# EasyEDA Pro project team_3.eprj

# Schematic main_board
Create Date: 2023-09-28; Page Name: P1; Project Name: team_3; Schematic Name: main_board; Update Date: 2023-11-21; Company: EasyEDA.com; Page Size: A3; Part Number: Esp32_main_borad; Version: V0.1
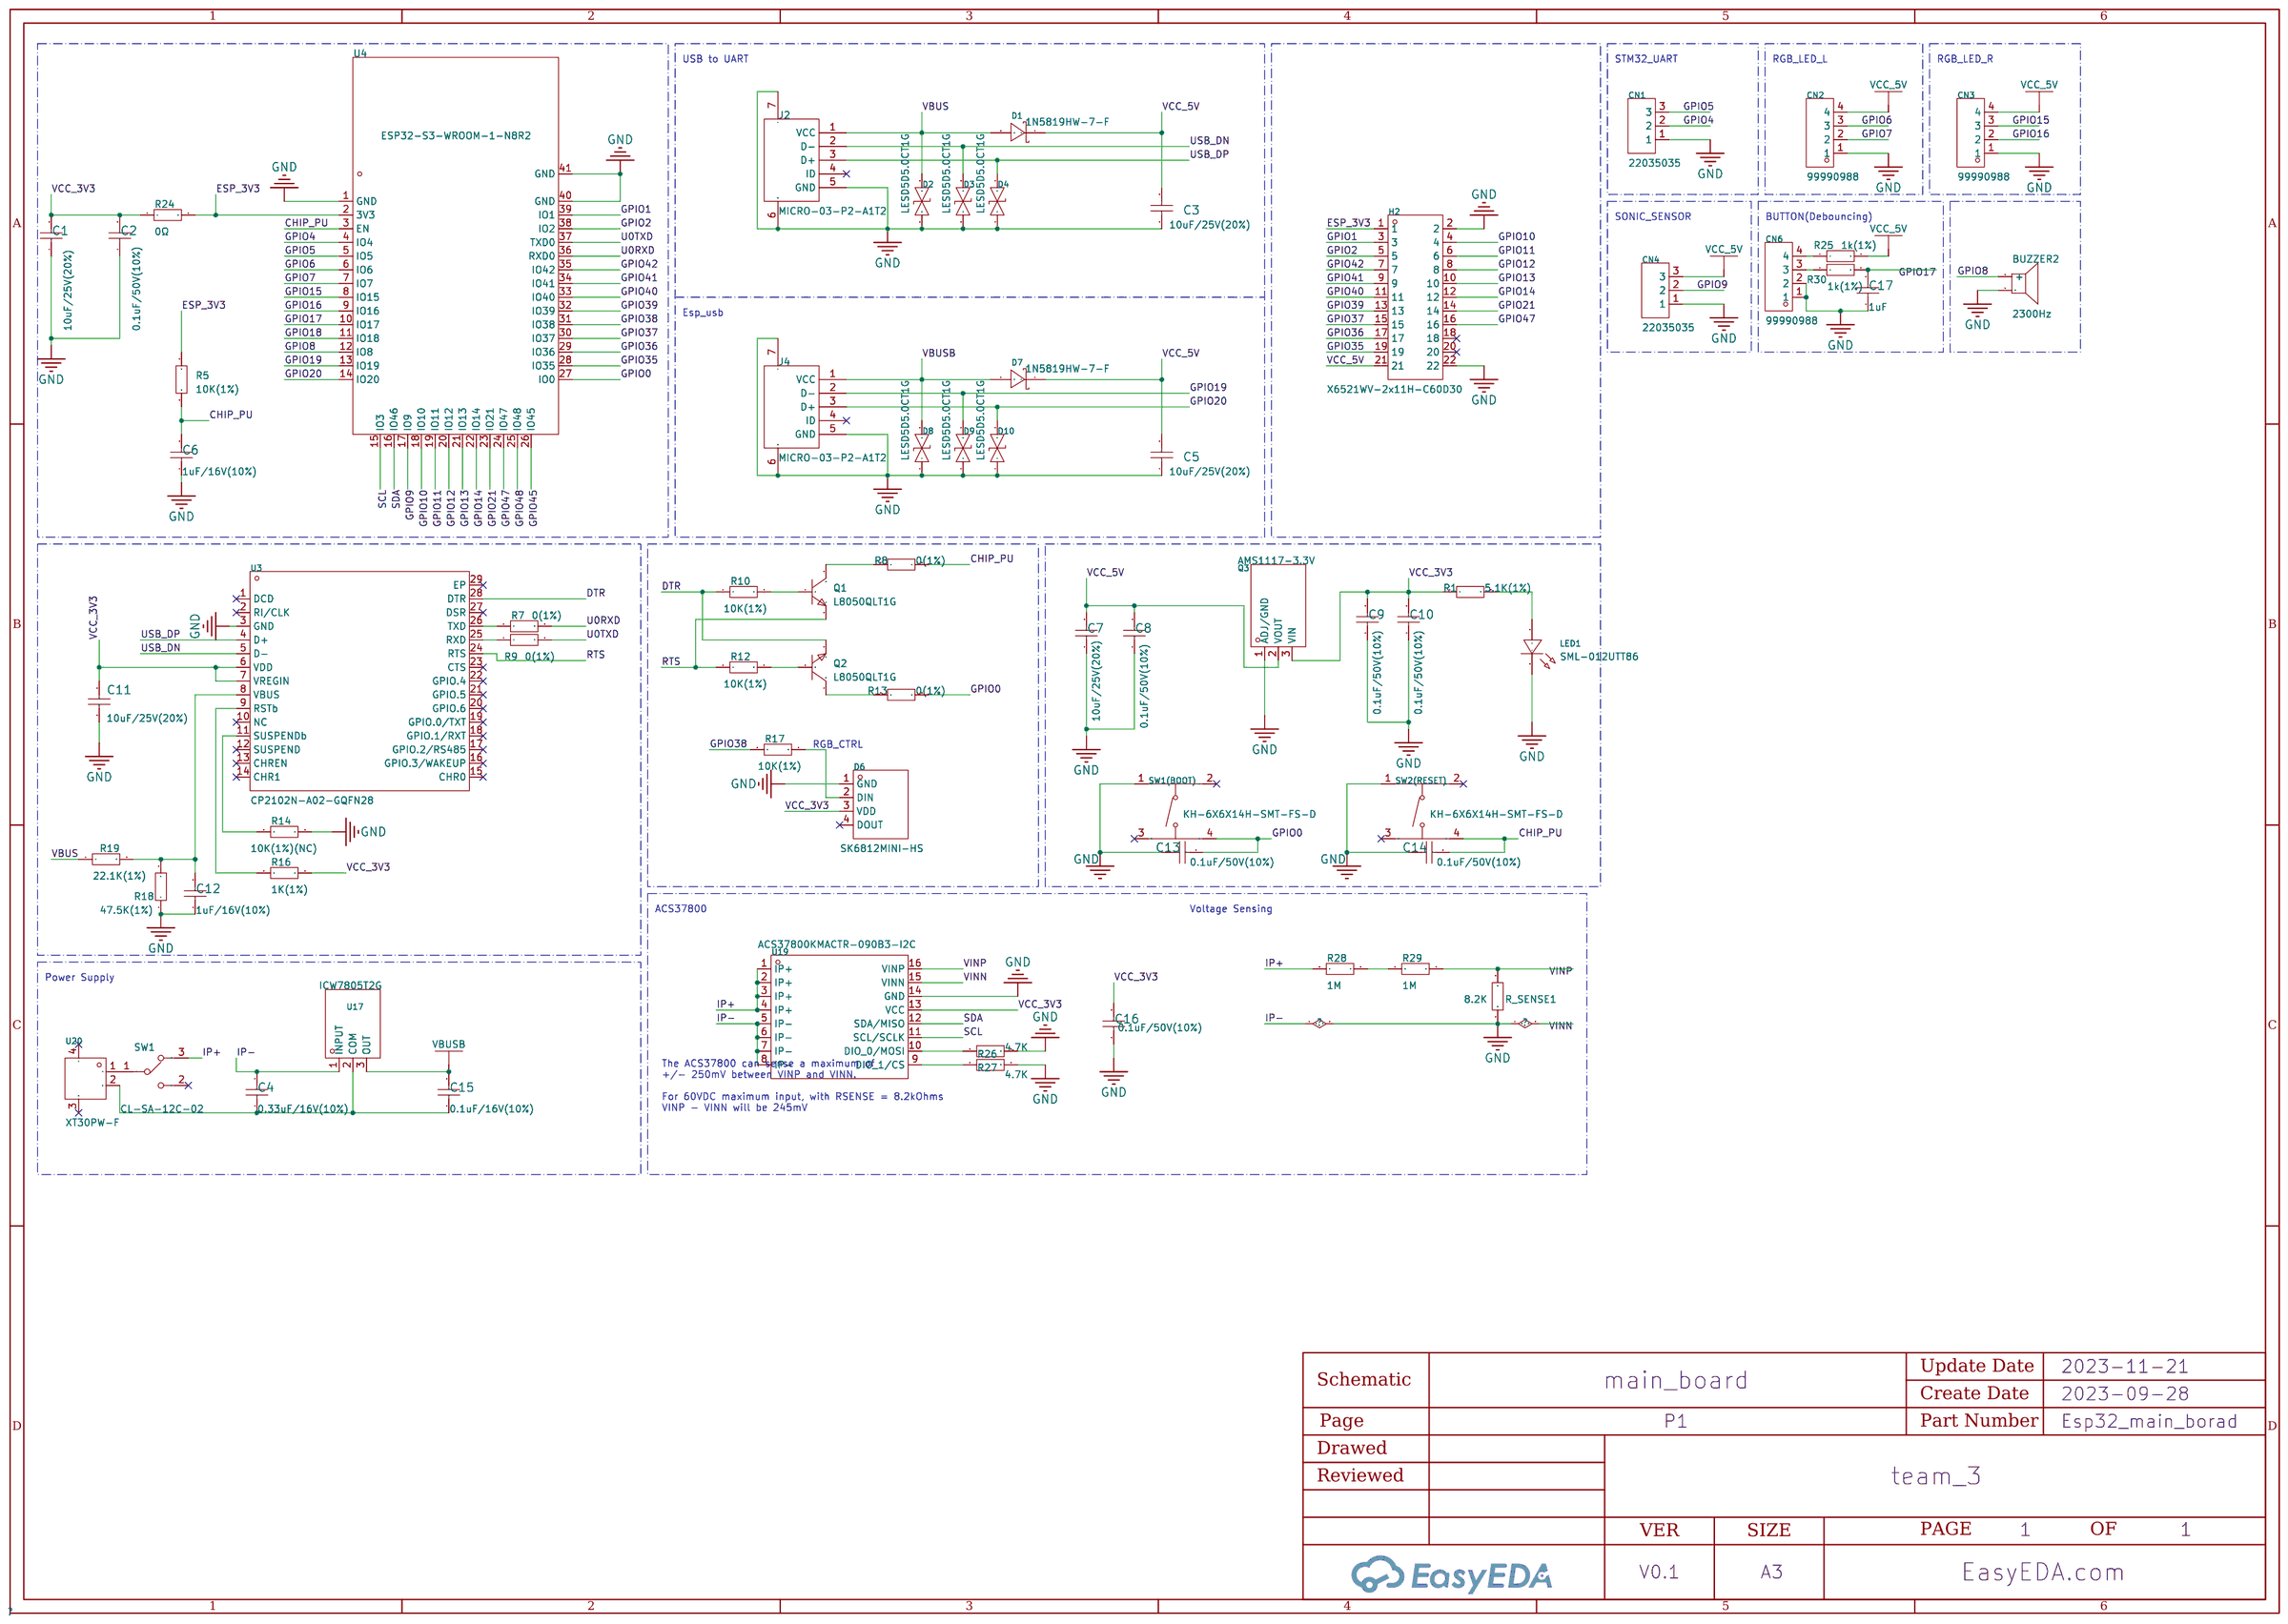
[diagram p0: schematic sheet]

## Parts
BUZZER2  2300Hz  [BUZ-TH_BD12.0-P7.60-D0.6-FD]
C1  10uF/25V(20%)  [C1206]
C2  0.1uF/50V(10%)  [C1206]
C3  10uF/25V(20%)  [C1206]
C4  0.33uF/16V(10%)  [C1206]
C5  10uF/25V(20%)  [C1206]
C6  1uF/16V(10%)  [C1206]
C7  10uF/25V(20%)  [C1206]
C8  0.1uF/50V(10%)  [C1206]
C9  0.1uF/50V(10%)  [C1206]
C10  0.1uF/50V(10%)  [C1206]
C11  10uF/25V(20%)  [C1206]
C12  1uF/16V(10%)  [C1206]
C13  0.1uF/50V(10%)  [C1206]
C14  0.1uF/50V(10%)  [C1206]
C15  0.1uF/16V(10%)  [C1206]
C16  0.1uF/50V(10%)  [C1206]
C17  1uF  [C1206]
CN1  22035035  [CONN-TH_22035035]
CN2  99990988  [CONN-TH_4P-P2.50_99990988]
CN3  99990988  [CONN-TH_4P-P2.50_99990988]
CN4  22035035  [CONN-TH_22035035]
CN6  99990988  [CONN-TH_4P-P2.50_99990988]
D1  1N5819HW-7-F  [SOD-123_L2.7-W1.6-LS3.7-RD]
D2  LESD5D5.0CT1G  [SOD-523_L1.2-W0.8-LS1.6-BI]
D3  LESD5D5.0CT1G  [SOD-523_L1.2-W0.8-LS1.6-BI]
D4  LESD5D5.0CT1G  [SOD-523_L1.2-W0.8-LS1.6-BI]
D6  SK6812MINI-HS  [LED-SMD_4P-L3.5-W3.5-BR_SK6812MINI-HS]
D7  1N5819HW-7-F  [SOD-123_L2.7-W1.6-LS3.7-RD]
D8  LESD5D5.0CT1G  [SOD-523_L1.2-W0.8-LS1.6-BI]
D9  LESD5D5.0CT1G  [SOD-523_L1.2-W0.8-LS1.6-BI]
D10  LESD5D5.0CT1G  [SOD-523_L1.2-W0.8-LS1.6-BI]
H2  X6521WV-2x11H-C60D30  [HDR-TH_22P-2.54-V-M-R2-C11-S2.54]
J2  MICRO-03-P2-A1T2  [MICRO-USB-SMD_MICRO-03-PX-A1T2]
J4  MICRO-03-P2-A1T2  [MICRO-USB-SMD_MICRO-03-PX-A1T2]
LED1  SML-012UTT86  [LED-SMD_L3.0-W2.0-R-RD_RED]
Q1  L8050QLT1G  [SOT-23-3_L2.9-W1.3-P1.90-LS2.4-BR]
Q2  L8050QLT1G  [SOT-23-3_L2.9-W1.3-P1.90-LS2.4-BR]
Q3  AMS1117-3.3V  [SOT-89-3_L4.5-W2.5-P1.50-LS4.2-BR]
R1  5.1K(1%)  [R1206]
R5  10K(1%)  [R1206]
R7  0(1%)  [R1206]
R8  0(1%)  [R1206]
R9  0(1%)  [R1206]
R10  10K(1%)  [R1206]
R12  10K(1%)  [R1206]
R13  0(1%)  [R1206]
R14  10K(1%)(NC)  [R1206]
R16  1K(1%)  [R1206]
R17  10K(1%)  [R1206]
R18  47.5K(1%)  [R1206]
R19  22.1K(1%)  [R1206]
R24  0Ω  [R1206]
R25  1k(1%)  [R1206]
R26  4.7K  [R1206]
R27  4.7K  [R1206]
R28  1M  [R1206]
R29  1M  [R1206]
R30  1k(1%)  [R1206]
R_SENSE1  8.2K  [R1206]
SW1  CL-SA-12C-02  [SW-TH_NIDEC_CL-SA-12C-02]
SW1(BOOT)  KH-6X6X14H-SMT-FS-D  [SW-SMD_4P-L6.0-W6.0-P4.50-LS9.5]
SW2(RESET)  KH-6X6X14H-SMT-FS-D  [SW-SMD_4P-L6.0-W6.0-P4.50-LS9.5]
U3  CP2102N-A02-GQFN28  [QFN-28_L5.0-W5.0-P0.50-TL-EP3.3]
U4  ESP32-S3-WROOM-1-N8R2  [WIRELM-SMD_ESP32-S3-WROOM-1]
U17  ICW7805T2G  [TO-252-2_L6.6-W6.1-P4.57-LS9.9-BR-CW]
U19  ACS37800KMACTR-090B3-I2C  [SOIC-16_L10.3-W7.5-P1.27-LS10.3-BL]
U20  XT30PW-F  [CONN-TH_XT30PW-F]

## Library data of the parts
BUZZER2 = TMB12A03_C96222: Oscillator Circuit:有源(内含驱动线路) Technology Type:电磁式 Rated Voltage:3V Operating Voltage:1.5V~4V Operating Voltage:1.5V~4V Frequency:2300Hz Sound Pressure Level (SPL):85dB@3V,10cm Diameter (φD):12mm Height:9.8mm; LCSC Part Name: TMB12A03; Supplier Part: C96222; Manufacturer: 华能; Manufacturer Part: TMB12A03; Supplier Footprint: 插件,D=12mm; JLCPCB Part Class: Extended Part; Datasheet: https://atta.szlcsc.com/upload/public/pdf/source/20211202/CAFCFF4D10B388AA00F36865319470DA.pdf; Supplier: LCSC; Oscillator Circuit: 有源(内含驱动线路); Technology Type: 电磁式; Rated Voltage: 3V; Operating Voltage: 1.5V~4V; Sound Pressure Level (SPL): 85dB@3V,10cm; Diameter (φD): 12mm; Height: 9.8mm
C1-C17 = CL31A226KAHNNNE: Capacitance: Tolerance:±10% Tolerance:±10% Voltage Rated: Temperature Coefficient:; LCSC Part Name: 22uF ±10% 25V; Supplier Part: C12891; Manufacturer: SAMSUNG(三星); Supplier Footprint: 1206; JLCPCB Part Class: Basic Part; Datasheet: https://atta.szlcsc.com/upload/public/pdf/source/20160218/1457707763339.pdf; Supplier: LCSC; Tolerance: ±10%
CN1 CN4 = 22035035: Reference Series:- Pitch:2.5mm Pins Structure:1x3P Number of Rows:1 Number of PINs Per Row:3 Row Spacing:- Mounting Style:- Contact Material:Brass; LCSC Part Name: 间距:2.5mm 1x3P 接头 通孔 锡; Supplier Part: C293315; Manufacturer: MOLEX; Supplier Footprint: 插件,P=2.5mm; JLCPCB Part Class: Extended Part; Datasheet: https://atta.szlcsc.com/upload/public/pdf/source/20200310/C492369_7C2DB16545F7632C1BAB5C1CED51D20C.pdf; Supplier: LCSC; Pitch: 2.5mm; Pins Structure: 1x3P; Number of Rows: 1; Number of PINs Per Row: 3; Contact Material: Brass
CN2 CN3 CN6 = 99990988: Reference Series:- Pitch:2.5mm Pins Structure:1x4P Number of Rows:1 Number of PINs Per Row:4 Row Spacing:- Mounting Style:- Contact Material:Brass; LCSC Part Name: 间距:2.5mm 1x4P; Supplier Part: C293734; Manufacturer: MOLEX; Supplier Footprint: 插件,P=2.5mm; JLCPCB Part Class: Extended Part; Datasheet: https://atta.szlcsc.com/upload/public/pdf/source/20181030/C293735_7F6EC290C398C64C520A3F541E21BCCE.pdf; Supplier: LCSC; Pitch: 2.5mm; Pins Structure: 1x4P; Number of Rows: 1; Number of PINs Per Row: 4; Contact Material: Brass
D1 D7 = 1N5819HW-7-F: Reverse Voltage (Vr):40V Average Rectified Current (Io):1A Forward Voltage (Vf@If):450mV@1A Reverse Leakage Current (Ir):1mA@40V; LCSC Part Name: 电压:40V 电流:1A; Supplier Part: C82544; Manufacturer: DIODES(美台); Supplier Footprint: SOD-123; JLCPCB Part Class: Extended Part; Datasheet: https://atta.szlcsc.com/upload/public/pdf/source/20161024/1477288459223.pdf; Supplier: LCSC; Reverse Voltage (Vr): 40V; Average Rectified Current (Io): 1A; Forward Voltage (Vf@If): 450mV@1A; Reverse Leakage Current (Ir): 1mA@40V
D2-D4 D8-D10 = LESD5D5.0CT1G_C5246195: Supplier Part: C5246195; Manufacturer: Leiditech(雷卯电子); Supplier Footprint: SOD-523; JLCPCB Part Class: Extended Part; Datasheet: https://atta.szlcsc.com/upload/public/pdf/source/20221108/1C42B36F7D16189BC2911DA9C8277455.pdf; Supplier: LCSC
D6 = SK6812MINI-HS: Supplier Part: C2922787; Manufacturer: 欧思科光电; Supplier Footprint: SMD,3.5x3.7mm; JLCPCB Part Class: Extended Part; Datasheet: https://atta.szlcsc.com/upload/public/pdf/source/20230410/362AD3320BBA53091A00A690D4E4D8BC.pdf; Supplier: LCSC
H2 = X6521WV-2x11H-C60D30: Number of Rows:双排 Number of Pins:22P Pitch:2.54mm Pin Structure:2x11P Row Spacing:2.54mm Mounting Type:Straight Circluar Pins/Square Pins:Square Pins Current Rating (Max):3A Voltage Rating (Max):250V Length of Mating Pin:6mm Insulation Height:2.5mm Length; LCSC Part Name: 间距:2.54mm 2x11P 直插 方针 高镀金 抗氧化; Supplier Part: C725883; Manufacturer: XKB Connectivity(中国星坤); Supplier Footprint: 插件,P=2.54mm; JLCPCB Part Class: Extended Part; Supplier: LCSC; Number of Rows: 双排; Number of Pins: 22P; Pitch: 2.54mm; Pin Structure: 2x11P; Row Spacing: 2.54mm; Mounting Type: Straight; Circluar Pins/Square Pins: Square Pins; Current Rating (Max): 3A; Voltage Rating (Max): 250V; Length of Mating Pin: 6mm; Insulation Height: 2.5mm; Length of End Connection Pin: 3mm; Contact Plating: Gold; Operating Temperature Range: -40℃~+105℃; Welding Temperature (Max): 260℃; Color: Black
J2 J4 = MICRO-03-P2-A1T2: Connector Type:Micro-B Standard:USB 2.0 Gender:Female Number of Contacts:5P Number of Ports:1 Mounting Style:Surface Mount Current Rating - Power (Max):1A Operating Temperature Range:- Operating Temperature Range:-; LCSC Part Name: Micro-B 母座 卧贴 有柱全贴有卷边针1; Supplier Part: C2682529; Manufacturer: Yuandi(元迪); Supplier Footprint: SMD; JLCPCB Part Class: Extended Part; Datasheet: https://atta.szlcsc.com/upload/public/pdf/source/20210114/C2682530_1DA2D4DD26655E983BE5171A1C11B75A.pdf; Supplier: LCSC; Connector Type: Micro-B; Standard: USB 2.0; Gender: Female; Number of Contacts: 5P; Number of Ports: 1; Mounting Style: Surface Mount; Current Rating - Power (Max): 1A
LED1 = SML-012UTT86: Emitted Color:红灯 Lens Color:无色透明 Dominant Wavelength:620nm~630nm Dominant Wavelength:620nm~630nm Forward Current:20mA Forward Voltage (VF):2V Forward Voltage (VF):2V; Supplier Part: C5336666; Manufacturer: ROHM(罗姆); Supplier Footprint: 1208; JLCPCB Part Class: Extended Part; Datasheet: https://atta.szlcsc.com/upload/public/pdf/source/20221223/03B791BDED291591D378DC550DDAE65C.pdf; Supplier: LCSC; Emitted Color: 红灯; Lens Color: 无色透明; Dominant Wavelength: 620nm~630nm; Forward Current: 20mA; Forward Voltage (VF): 2V
Q1 Q2 = L8050QLT1G: Transistor Type: Collector-Emitter Breakdown Voltage (Vceo): Collector Current (Ic): Power Dissipation (Pd):; LCSC Part Name: NPN 25V 800mA; Supplier Part: C49581; Manufacturer: LRC(乐山无线电); Supplier Footprint: SOT-23; JLCPCB Part Class: Extended Part; Datasheet: https://atta.szlcsc.com/upload/public/pdf/source/20150518/1457707314424.pdf; Supplier: LCSC
Q3 = AMS1117-3.3V_C5120796: Output Type: Output Polarity:Positive Number of Outputs:1 Maximum Input Voltage:18V Output Voltage:3.3V Output Voltage:3.3V Dropout Voltage:1.4V@(1A) Quiescent Current (Ground Current):12mA Output Current:1A Operating Temperature:0℃~+125℃ Operating Temper; LCSC Part Name: 输入18V 输出3.3V 1A; Supplier Part: C5120796; Manufacturer: MSKSEMI(美森科); Supplier Footprint: SOT-89; JLCPCB Part Class: Extended Part; Datasheet: https://atta.szlcsc.com/upload/public/pdf/source/20230802/A3918E880B22D5DA08FB6633703CD81C.pdf; Supplier: LCSC; Output Polarity: Positive; Number of Outputs: 1; Maximum Input Voltage: 18V; Output Voltage: 3.3V; Dropout Voltage: 1.4V@(1A); Quiescent Current (Ground Current): 12mA; Output Current: 1A; Operating Temperature: 0℃~+125℃
R1 R5 R7-R10 R12-R14 R16-R19 R24-R30 R_SENSE1 = 1206W4F0000T5E: Type:Thick Film Resistors Resistance: Tolerance:±1% Tolerance:±1% Power(Watts):250mW Temperature Coefficient:±800ppm/℃ Temperature Coefficient:±800ppm/℃ Overload Voltage (Max): Operating Temperature Range:-55℃~+155℃ Operating Temperature Range:-55℃~+155℃; LCSC Part Name: 0Ω ±1% 250mW; Supplier Part: C17888; Manufacturer: UNI-ROYAL(厚声); Supplier Footprint: 1206; JLCPCB Part Class: Basic Part; Supplier: LCSC; Type: Thick Film Resistors; Tolerance: ±1%; Power(Watts): 250mW; Temperature Coefficient: ±800ppm/℃; Operating Temperature Range: -55℃~+155℃
SW1 = CL-SA-12C-02: Current Rating (DC):100mA Voltage Rating (DC):50V Circuit:SPDT Mounting Style:Straight Mechanical Life:- Actuator Color:White Pin Style:PCPin Operating Temperature:-40℃~+85℃ Operating Temperature:-40℃~+85℃ Switch Length:10mm Switch Width:2.54mm Switch Hei; LCSC Part Name: 直插两档 滑动开关; Supplier Part: C2921639; Manufacturer: NIDEC(尼得科); JLCPCB Part Class: Extended Part; Datasheet: https://atta.szlcsc.com/upload/public/pdf/source/20220330/3F9B16E5809B2A105669445D41B4F536.pdf; Supplier: LCSC; Current Rating (DC): 100mA; Voltage Rating (DC): 50V; Circuit: SPDT; Mounting Style: Straight; Actuator Color: White; Pin Style: PCPin; Operating Temperature: -40℃~+85℃; Switch Length: 10mm; Switch Width: 2.54mm; Switch Height: 6.4mm
SW1(BOOT) SW2(RESET) = KH-6X6X14H-SMT-FS-D: LCSC Part Name: 轻触开关6*6*14H防水贴片 袋装; Supplier Part: C18186518; Manufacturer: kinghelm(金航标); Supplier Footprint: SMD,6x6mm; Datasheet: https://atta.szlcsc.com/upload/public/pdf/source/20230919/ED0E7458BA42BEACFB6D3A5E00D3A6F9.pdf; Supplier: LCSC
U3 = CP2102N-A02-GQFN28: Applications Function:USB转UART Protocol:UART Supply Voltage:3V~3.6V Supply Voltage:3V~3.6V Operating Temperature:-40℃~+85℃@(Ta) Operating Temperature:-40℃~+85℃@(Ta); Supplier Part: C1550553; Manufacturer: SILICON LABS(芯科); Supplier Footprint: QFN-28-EP(5x5); JLCPCB Part Class: Extended Part; Datasheet: https://atta.szlcsc.com/upload/public/pdf/source/20201204/C964632_F2B790CC23A72455AEF523510305B30A.pdf; Supplier: LCSC; Applications Function: USB转UART; Protocol: UART; Supply Voltage: 3V~3.6V; Operating Temperature: -40℃~+85℃@(Ta)
U4 = ESP32-S3-WROOM-1-N8R2: Supplier Part: C2913204; Manufacturer: ESPRESSIF(乐鑫); Supplier Footprint: SMD,18x25.5mm; JLCPCB Part Class: Extended Part; Datasheet: https://atta.szlcsc.com/upload/public/pdf/source/20220628/A2AC12B3C87735CAEB7EBE2DBE80936C.pdf; Supplier: LCSC
U17 = ICW7805T2G: Maximum Input Voltage:40V Output Voltage:5V Output Voltage:5V Quiescent Current (Ground Current):3mA Output Current:1.2A; LCSC Part Name: 30V,1A固定输出,三端正电源稳压电路; Supplier Part: C7544936; Manufacturer: ICW(艾创微); Supplier Footprint: TO-252; Datasheet: https://atta.szlcsc.com/upload/public/pdf/source/20230825/646A12CA7BB340D06A31B928F5FFD201.pdf; Supplier: LCSC; Maximum Input Voltage: 40V; Output Voltage: 5V; Quiescent Current (Ground Current): 3mA; Output Current: 1.2A
U19 = ACS37800KMACTR-090B3-I2C: Output Type:- Reset Active Level:- Threshold Voltage:- Reset Timeout:- Operating Temperature:-40℃~+125℃@(TA) Operating Temperature:-40℃~+125℃@(TA) Type of the Power Management Chip:电源监控器; Supplier Part: C3686098; Manufacturer: ALLEGRO(美国埃戈罗); Supplier Footprint: SOP-16; JLCPCB Part Class: Extended Part; Supplier: LCSC; Operating Temperature: -40℃~+125℃@(TA); Type of the Power Management Chip: 电源监控器
U20 = XT30PW-F: Brand:艾迈斯 Model:XT30PW-F Power:- Output:- Input:- Size:- Interface:- Type:- Colour:- MaximumCurrent:- Type:航模插头 RatedVoltage:- Type1:- NumberOfUSBHoles:- InterfaceType:母头 MetalMaterial:- InsulationMaterial:- RatedCurrent:- RecommendedWireGauge:- FlameReta; LCSC Part Name: AMASS(艾迈斯)电源连接器 母头 XT30PW-F; Supplier Part: C2913282; Manufacturer: AMASS(艾迈斯); JLCPCB Part Class: Extended Part; Datasheet: https://atta.szlcsc.com/upload/public/pdf/source/20190916/C428722_DFF78979486FCB0B58C1FC563067EC88.pdf; Supplier: LCSC; Brand: 艾迈斯; Type: 航模插头; InterfaceType: 母头

## Nets
GND: BUZZER2.2 C1.1 C2.1 C3.1 C4.2 C5.1 C6.1 C7.1 C8.1 C9.1 C10.1 C11.1 C12.1 C13.1 C14.1 C16.1 C17.1 CN1.1 CN2.1 CN3.1 CN4.1 CN6.1 CN6.2 D2.1 D3.1 D4.1 D6.1(GND) D8.1 D9.1 D10.1 H2.2 H2.22 J2.5(GND) J2.6 J2.7 J4.5(GND) J4.6 J4.7 LED1.2(-) Q3.1(ADJ/GND) R14.2 R18.1 R26.2 R27.2 R_SENSE1.1 SW1(BOOT).1 SW2(RESET).1 U3.3(GND) U4.1(GND) U4.40(GND) U4.41(GND) U17.1(INPUT) U19.5(IP-) U19.6(IP-) U19.7(IP-) U19.8(IP-) U19.14(GND) U19.15(VINN)
VBUS: D1.2(A) D2.2 J2.1(VCC) R19.1
VBUSB: C15.2 D7.2(A) D8.2 J4.1(VCC) U17.3(OUT)
VCC_3V3: C1.2 C2.2 C9.2 C10.2 C11.2 C16.2 D6.3(VDD) Q3.3(VIN) R1.1 R16.2 R24.1 U3.6(VDD) U3.7(VREGIN) U19.13(VCC)
VCC_5V: C3.2 C5.2 C7.2 C8.2 CN2.4 CN3.4 CN4.3 D1.1(K) D7.1(K) H2.21 Q3.2(VOUT) R25.2
VINP: R29.2 R_SENSE1.2 U19.16(VINP)
CHIP_PU: C6.2 C14.2 R5.1 R8.2 SW2(RESET).4 U4.3(EN)
DTR: Q2.2(E) R10.1 U3.28(DTR)
ESP_3V3: H2.1 R5.2 R24.2 U4.2(3V3)
GPIO0: C13.2 R13.2 SW1(BOOT).4 U4.27(IO0)
GPIO1: H2.3 U4.39(IO1)
GPIO2: H2.5 U4.38(IO2)
GPIO4: CN1.2 U4.4(IO4)
GPIO5: CN1.3 U4.5(IO5)
GPIO6: CN2.3 U4.6(IO6)
GPIO7: CN2.2 U4.7(IO7)
GPIO8: BUZZER2.1(+) U4.12(IO8)
GPIO9: CN4.2 U4.17(IO9)
GPIO10: H2.4 U4.18(IO10)
GPIO11: H2.6 U4.19(IO11)
GPIO12: H2.8 U4.20(IO12)
GPIO13: H2.10 U4.21(IO13)
GPIO14: H2.12 U4.22(IO14)
GPIO15: CN3.3 U4.8(IO15)
GPIO16: CN3.2 U4.9(IO16)
GPIO17: C17.2 R30.2 U4.10(IO17)
GPIO18: U4.11(IO18)
GPIO19: D9.2 J4.2(D-) U4.13(IO19)
GPIO20: D10.2 J4.3(D+) U4.14(IO20)
GPIO21: H2.14 U4.23(IO21)
GPIO35: H2.19 U4.28(IO35)
GPIO36: H2.17 U4.29(IO36)
GPIO37: H2.15 U4.30(IO37)
GPIO38: R17.1 U4.31(IO38)
GPIO39: H2.13 U4.32(IO39)
GPIO40: H2.11 U4.33(IO40)
GPIO41: H2.9 U4.34(IO41)
GPIO42: H2.7 U4.35(IO42)
GPIO45: U4.26(IO45)
GPIO47: H2.16 U4.24(IO47)
GPIO48: U4.25(IO48)
IP+: R28.1 SW1.3 U19.1(IP+) U19.2(IP+) U19.3(IP+) U19.4(IP+)
RTS: Q1.2(E) R12.1 U3.24(RTS)
SCL: U4.15(IO3) U19.11(SCL/SCLK)
SDA: U4.16(IO46) U19.12(SDA/MISO)
U0RXD: R7.2 U4.36(RXD0)
U0TXD: R9.2 U4.37(TXD0)
USB_DN: D3.2 J2.2(D-) U3.5(D-)
USB_DP: D4.2 J2.3(D+) U3.4(D+)
$1N5776: C12.2 R18.2 R19.2 U3.8(VBUS)
$1N5824: R16.1 U3.9(RSTb)
$1N5829: R14.1 U3.11(SUSPENDb)
$1N5930: R7.1 U3.26(TXD)
$1N5933: R9.1 U3.25(RXD)
$1N6311: Q1.1(B) R10.2
$1N6314: Q2.1(B) R12.2
$1N6341: Q1.3(C) R8.1
$1N6344: Q2.3(C) R13.1
$1N6473: D6.2(DIN) R17.2
$1N6796: LED1.1(+) R1.2
$1N25492: CN6.4 R25.1
$1N27294: R26.1 U19.10(DIO_0/MOSI)
$1N27297: R27.1 U19.9(DIO_1/CS)
$1N27555: R28.2 R29.1
$1N27664: C4.1 C15.1 U17.2(COM) U20.2
$1N27833: CN6.3 R30.1
$1N34757: SW1.1 U20.1

Not connected (* = marked no-connect by the designer): D6 4(DOUT)*; H2 18* 20*; J2 4(ID)*; J4 4(ID)*; SW1 2*; SW1(BOOT) 2* 3*; SW2(RESET) 2* 3*; U3 1(DCD)* 2(RI/CLK)* 10(NC)* 12(SUSPEND)* 13(CHREN)* 14(CHR1)* 15(CHR0)* 16(GPIO.3/WAKEUP)* 17(GPIO.2/RS485)* 18(GPIO.1/RXT)* 19(GPIO.0/TXT)* 20(GPIO.6)* 21(GPIO.5)* 22(GPIO.4)* 23(CTS)* 27(DSR)* 29(EP)*; U20 3* 4*

## Notes on the sheet
- USB to UART
- STM32_UART
- RGB_LED_L
- RGB_LED_R
- SONIC_SENSOR
- BUTTON(Debouncing)
- Esp_usb
- RGB_CTRL
- ACS37800
- Voltage Sensing
- Power Supply
- The ACS37800 can sense a maximum of
  +/- 250mV between VINP and VINN.
  For 60VDC maximum input, with RSENSE = 8.2kOhms
  VINP - VINN will be 245mV

# Board PCB1
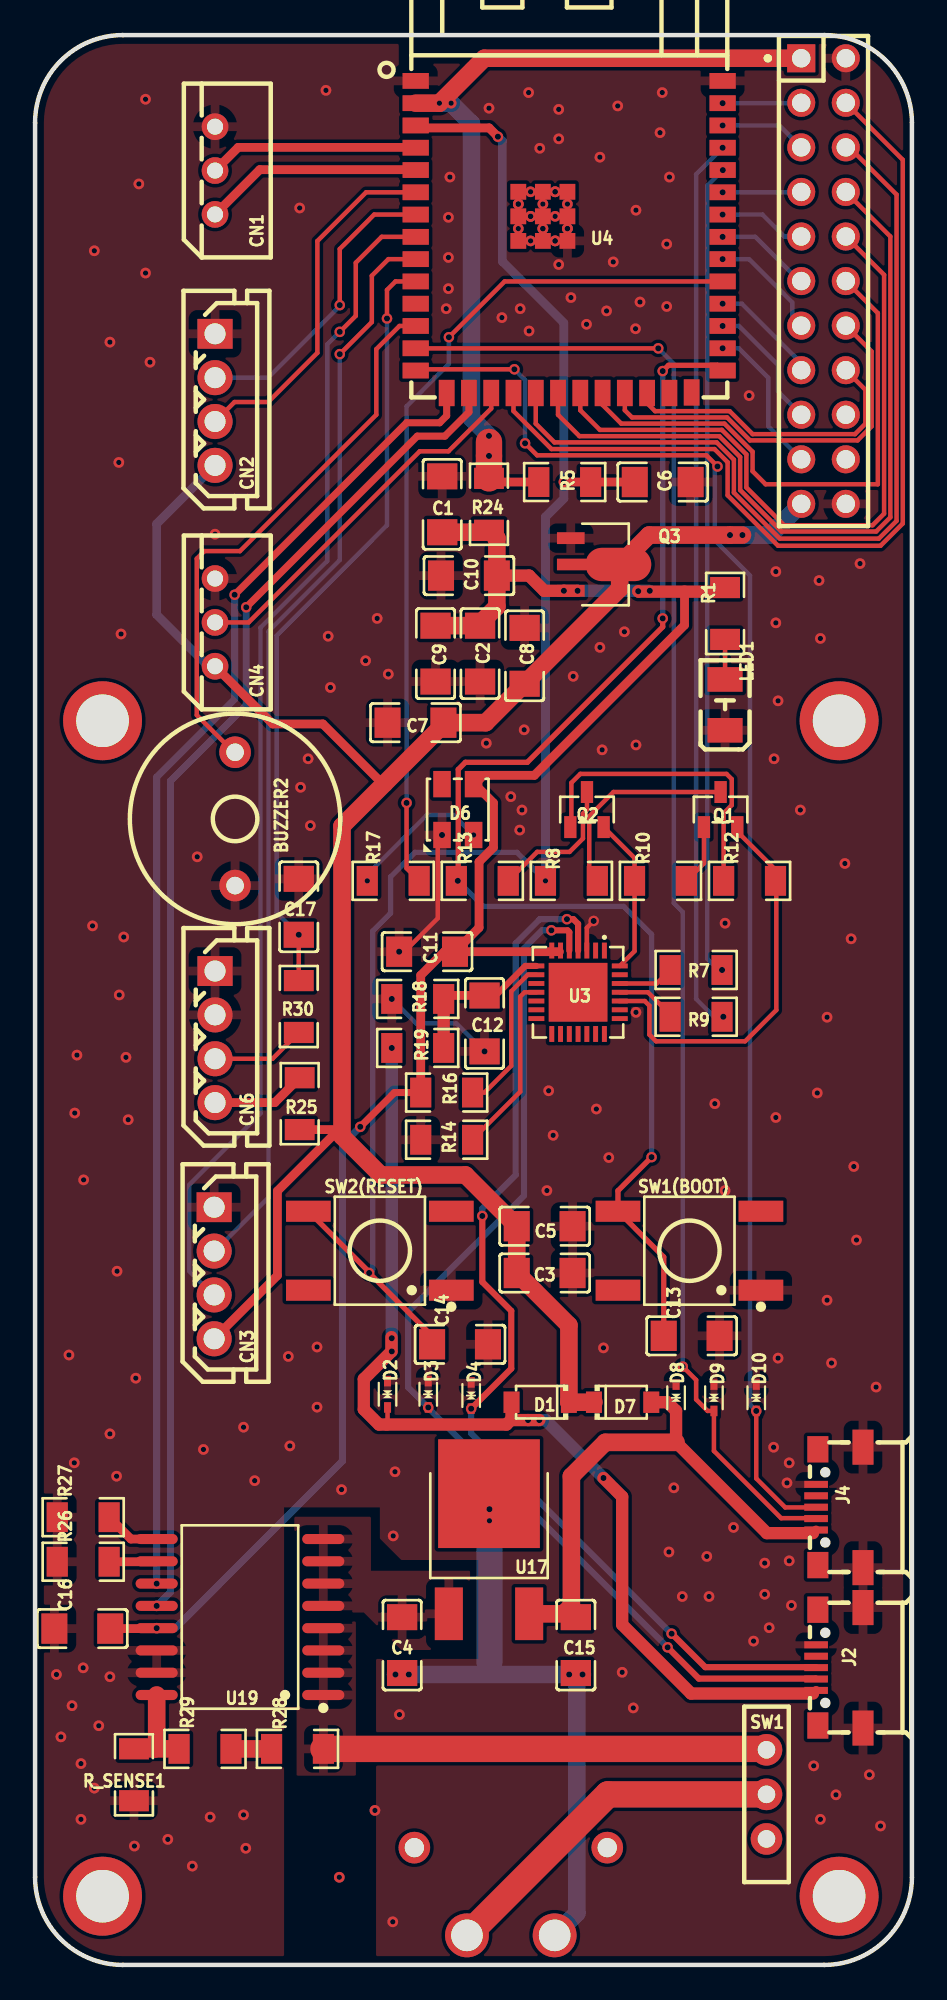
[diagram p1: board, top side]
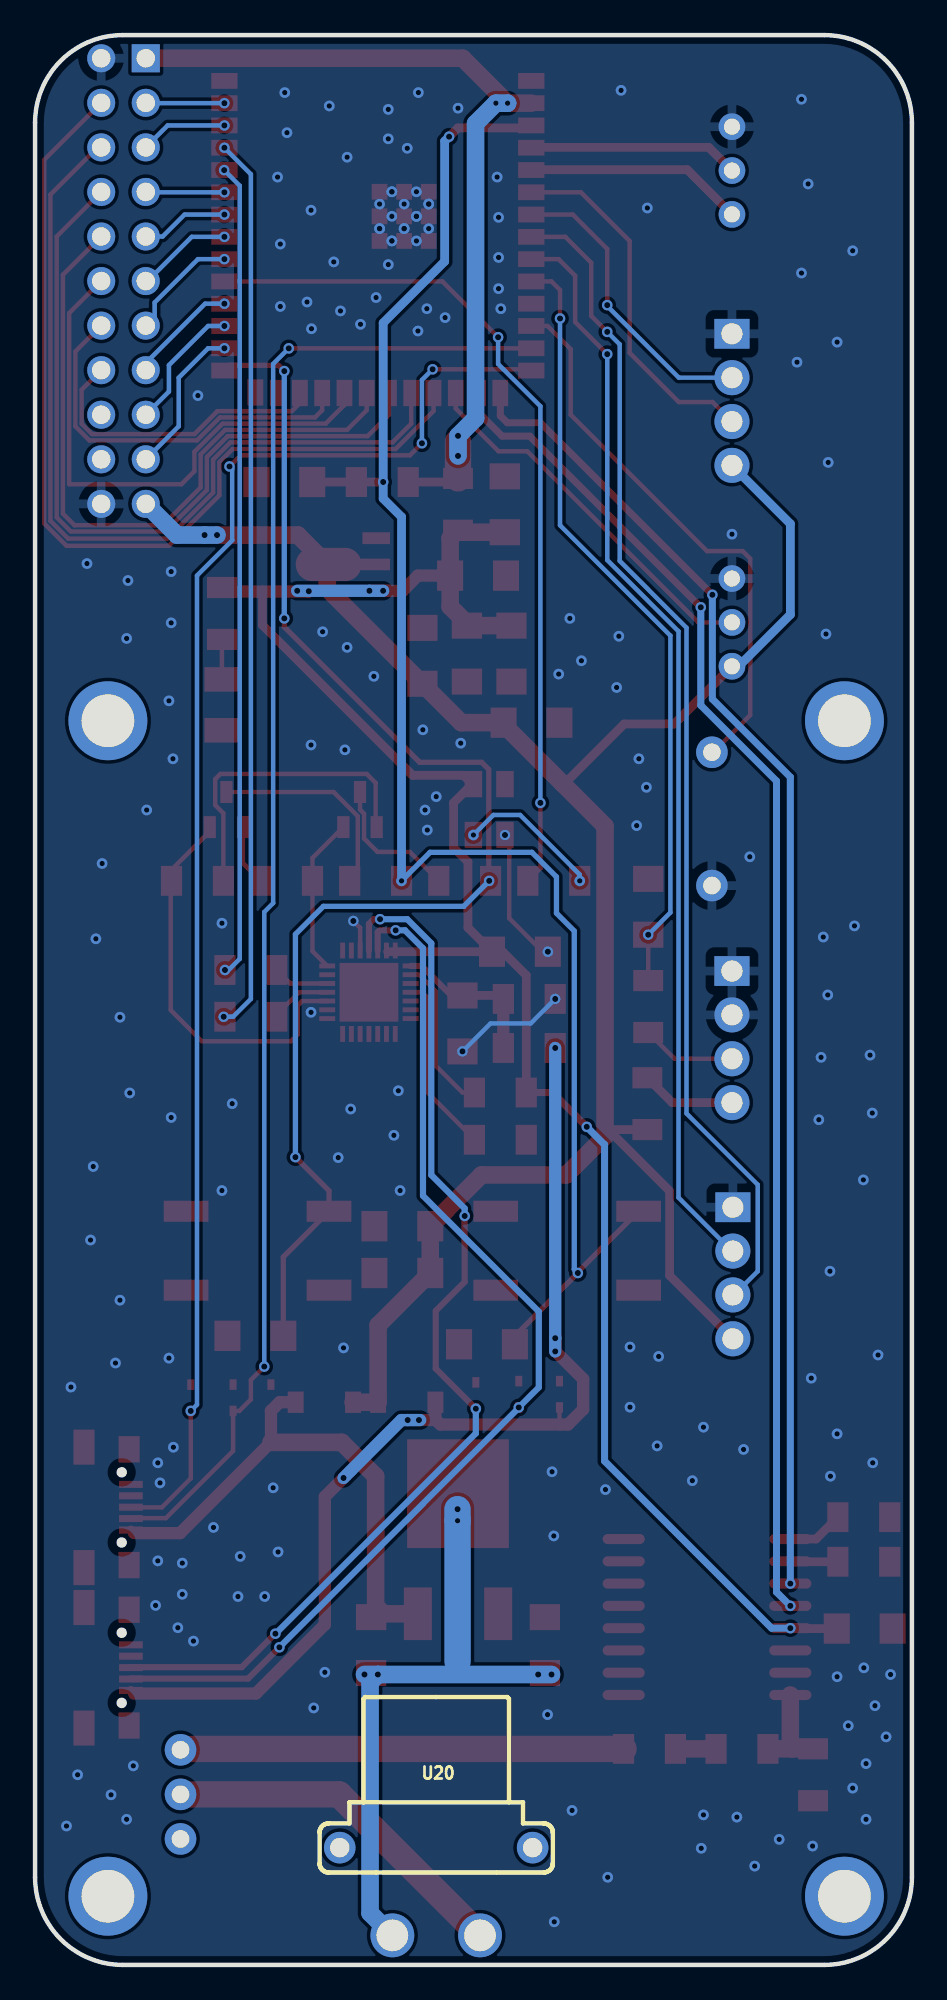
[diagram p2: board, bottom side, seen from below]

Outline 50 x 110 mm; copper layers: Top Layer, Bottom Layer. Coordinates in mm from the lower left corner of the outline.
Outline path: 0,105 0,5 arc(1.46,1.46) 5,0 45,0 arc(48.54,1.46) 50,5 50,105 arc(48.54,108.54) 45,110 5,110 arc(1.46,108.54) 0,105
Stack: Top Layer 0.035mm / Dielectric1 1.51mm FR4 er 4.5 / Bottom Layer 0.035mm

## Design rules (mm)
template: Custom Config
spacing copperThickness1oz (default): track to track 0.102, other pairs 0.152 to 0.3
spacing copperThickness2oz: track to track 0.203, other pairs 0.152 to 0.3
track width copperThickness1oz (default): min 0.127, default 0.254, max 2.54
track width copperThickness2oz: min 0.203, default 0.254, max 2.54
differential pair differentialPair (default): width min 0.127, default 0.254, max 2.54; gap min 0.152, default 0.152
via viaSize (default): diameter min 0.5, default 0.61, max 10; hole min 0.3, default 0.305, max 6.3

## Placement (name value [footprint] x y rotation side)
BUZZER2  2300Hz  [BUZ-TH_BD12.0-P7.60-D0.6-FD]  11.4 65.32 270 top
C1  10uF/25V(20%)  [C1206]  23.22 83.25 270 top
C2  0.1uF/50V(10%)  [C1206]  25.37 74.74 90 top
C3  10uF/25V(20%)  [C1206]  29.06 39.44 180 top
C4  0.33uF/16V(10%)  [C1206]  20.93 18.23 90 top
C5  10uF/25V(20%)  [C1206]  29.06 42.11 180 top
C6  1uF/16V(10%)  [C1206]  35.79 84.52 180 top
C7  10uF/25V(20%)  [C1206]  21.69 70.81 0 top
C8  0.1uF/50V(10%)  [C1206]  27.91 74.62 270 top
C9  0.1uF/50V(10%)  [C1206]  22.83 74.74 90 top
C10  0.1uF/50V(10%)  [C1206]  24.74 79.19 0 top
C11  10uF/25V(20%)  [C1206]  22.35 57.75 0 top
C12  1uF/16V(10%)  [C1206]  25.63 53.66 90 top
C13  0.1uF/50V(10%)  [C1206]  37.44 35.86 180 top
C14  0.1uF/50V(10%)  [C1206]  24.23 35.37 180 top
C15  0.1uF/16V(10%)  [C1206]  30.84 18.23 90 top
C16  0.1uF/50V(10%)  [C1206]  2.69 19.17 0 top
C17  1uF  [C1206]  15.04 60.31 270 top
CN1  22035035  [CONN-TH_22035035]  10.26 102.28 90 top
CN2  99990988  [CONN-TH_4P-P2.50_99990988]  10.26 89.22 90 top
CN3  99990988  [CONN-TH_4P-P2.50_99990988]  10.21 39.44 90 top
CN4  22035035  [CONN-TH_22035035]  10.26 76.52 90 top
CN6  99990988  [CONN-TH_4P-P2.50_99990988]  10.26 52.9 90 top
D1  1N5819HW-7-F  [SOD-123_L2.7-W1.6-LS3.7-RD]  28.8 32.07 180 top
D2  LESD5D5.0CT1G  [SOD-523_L1.2-W0.8-LS1.6-BI]  20.1 32.53 270 top
D3  LESD5D5.0CT1G  [SOD-523_L1.2-W0.8-LS1.6-BI]  22.42 32.53 270 top
D4  LESD5D5.0CT1G  [SOD-523_L1.2-W0.8-LS1.6-BI]  24.87 32.45 270 top
D6  SK6812MINI-HS  [LED-SMD_4P-L3.5-W3.5-BR_SK6812MINI-HS]  24.1 65.85 270 top
D7  1N5819HW-7-F  [SOD-123_L2.7-W1.6-LS3.7-RD]  33.5 32.07 0 top
D8  LESD5D5.0CT1G  [SOD-523_L1.2-W0.8-LS1.6-BI]  36.55 32.33 270 top
D9  LESD5D5.0CT1G  [SOD-523_L1.2-W0.8-LS1.6-BI]  38.71 32.33 270 top
D10  LESD5D5.0CT1G  [SOD-523_L1.2-W0.8-LS1.6-BI]  41.12 32.33 270 top
H2  X6521WV-2x11H-C60D30  [HDR-TH_22P-2.54-V-M-R2-C11-S2.54]  44.96 95.98 270 top
J2  MICRO-03-P2-A1T2  [MICRO-USB-SMD_MICRO-03-PX-A1T2]  45.87 16.93 90 top
J4  MICRO-03-P2-A1T2  [MICRO-USB-SMD_MICRO-03-PX-A1T2]  45.87 26.08 90 top
LED1  SML-012UTT86  [LED-SMD_L3.0-W2.0-R-RD_RED]  39.34 71.82 90 top
NOREF  -  [Pad_e965]  45.85 70.92 0 top
NOREF#2  -  [Pad_e1493]  3.85 70.92 0 top
NOREF#3  -  [Pad_e1491]  45.85 3.92 0 top
NOREF#4  -  [Pad_e1492]  3.85 3.92 0 top
Q1  L8050QLT1G  [SOT-23-3_L2.9-W1.3-P1.90-LS2.4-BR]  39.09 65.85 270 top
Q2  L8050QLT1G  [SOT-23-3_L2.9-W1.3-P1.90-LS2.4-BR]  31.47 65.85 270 top
Q3  AMS1117-3.3V  [SOT-89-3_L4.5-W2.5-P1.50-LS4.2-BR]  31.9 79.82 180 top
R1  5.1K(1%)  [R1206]  39.34 77.03 270 top
R5  10K(1%)  [R1206]  30.2 84.52 180 top
R7  0(1%)  [R1206]  37.69 56.71 0 top
R8  0(1%)  [R1206]  30.58 61.79 180 top
R9  0(1%)  [R1206]  37.69 54.04 0 top
R10  10K(1%)  [R1206]  35.66 61.79 0 top
R12  10K(1%)  [R1206]  40.74 61.79 180 top
R13  0(1%)  [R1206]  25.5 61.79 180 top
R14  10K(1%)(NC)  [R1206]  23.47 47.03 180 top
R16  1K(1%)  [R1206]  23.47 49.73 180 top
R17  10K(1%)  [R1206]  20.42 61.79 180 top
R18  47.5K(1%)  [R1206]  21.82 55.06 0 top
R19  22.1K(1%)  [R1206]  21.82 52.27 0 top
R24  0Ω  [R1206]  25.88 83.25 90 top
R25  1k(1%)  [R1206]  15.09 49.09 270 top
R26  4.7K  [R1206]  2.74 22.98 180 top
R27  4.7K  [R1206]  2.74 25.52 180 top
R28  1M  [R1206]  14.96 12.31 180 top
R29  1M  [R1206]  9.69 12.31 180 top
R30  1k(1%)  [R1206]  15.04 54.63 90 top
R_SENSE1  8.2K  [R1206]  5.64 10.84 90 top
SW1  CL-SA-12C-02  [SW-TH_NIDEC_CL-SA-12C-02]  41.71 9.72 90 top
SW1(BOOT)  KH-6X6X14H-SMT-FS-D  [SW-SMD_4P-L6.0-W6.0-P4.50-LS9.5]  37.31 40.71 180 top
SW2(RESET)  KH-6X6X14H-SMT-FS-D  [SW-SMD_4P-L6.0-W6.0-P4.50-LS9.5]  19.66 40.71 180 top
U3  CP2102N-A02-GQFN28  [QFN-28_L5.0-W5.0-P0.50-TL-EP3.3]  30.96 55.44 270 top
U4  ESP32-S3-WROOM-1-N8R2  [WIRELM-SMD_ESP32-S3-WROOM-1]  30.45 98.49 0 top
U17  ICW7805T2G  [TO-252-2_L6.6-W6.1-P4.57-LS9.9-BR-CW]  25.88 23.44 270 top
U19  ACS37800KMACTR-090B3-I2C  [SOIC-16_L10.3-W7.5-P1.27-LS10.3-BL]  11.68 19.83 90 top
U20  XT30PW-F  [CONN-TH_XT30PW-F]  27.13 4.18 0 bottom

## Footprints (pads in the part's own frame, mm; a bottom-side part is the same pattern mirrored in y, then rotated)
BUZ-TH_BD12.0-P7.60-D0.6-FD
  round 1.8 hole 1: 1(-3.8,0) 2(3.8,0)
C1206
  rect 1.485x1.728 smd: 1(-1.593,0) 2(1.593,0)
CONN-TH_4P-P2.50_99990988
  rect 1.7x2 hole 1.2: 1(3.75,0)
  round 2 hole 1.2: 2(1.25,0) 3(-1.25,0) 4(-3.75,0)
CONN-TH_22035035
  round 1.524 hole 0.914: 1(2.5,0) 2(0,0) 3(-2.5,0)
CONN-TH_XT30PW-F
  round 2.5 hole 1.8: 1(-2.5,2.5) 2(2.5,2.5)
  round 1.8 hole 1.1: 3(5.5,-2.5) 4(-5.5,-2.5)
HDR-TH_22P-2.54-V-M-R2-C11-S2.54
  rect 1.6x1.6 hole 1.05: 1(-12.7,-1.27)
  round 1.6 hole 1.05: 2(-12.7,1.27) 3(-10.16,-1.27) 4(-10.16,1.27) 5(-7.62,-1.27) 6(-7.62,1.27) 7(-5.08,-1.27) 8(-5.08,1.27) 9(-2.54,-1.27) 10(-2.54,1.27) 11(0,-1.27) 12(0,1.27) 13(2.54,-1.27) 14(2.54,1.27) 15(5.08,-1.27) 16(5.08,1.27) 17(7.62,-1.27) 18(7.62,1.27) 19(10.16,-1.27) 20(10.16,1.27) 21(12.7,-1.27) 22(12.7,1.27)
LED-SMD_4P-L3.5-W3.5-BR_SK6812MINI-HS
  rect 1.5x1 smd: 1(1.45,-0.9) 2(1.45,0.9) 3(-1.45,0.9) 4(-1.45,-0.9)
LED-SMD_L3.0-W2.0-R-RD_RED
  rect 1.4x2 smd: 1(1.45,0) 2(-1.45,0)
MICRO-USB-SMD_MICRO-03-PX-A1T2
  rect 0.4x1.35 smd: 1(-1.288,1.337) 2(-0.638,1.337) 3(0.011,1.337) 4(0.661,1.337) 5(1.312,1.337)
  rect 2x1.2 smd: 6(-3.434,-1.337) 7(3.434,-1.337)
  rect 1.5x1.2 smd: 6(-3.288,1.238) 7(3.312,1.238)
Pad_e965
  round 4.5 hole 3: 1(0,0)
Pad_e1491
  round 4.5 hole 3: 1(0,0)
Pad_e1492
  round 4.5 hole 3: 1(0,0)
Pad_e1493
  round 4.5 hole 3: 1(0,0)
QFN-28_L5.0-W5.0-P0.50-TL-EP3.3
  rect 0.905x0.28 smd: 1(-2.377,1.5) 2(-2.377,1) 3(-2.377,0.5) 4(-2.377,0) 5(-2.377,-0.5) 6(-2.377,-1) 7(-2.377,-1.5) 15(2.377,-1.5) 16(2.377,-1) 17(2.377,-0.5) 18(2.377,0) 19(2.377,0.5) 20(2.377,1) 21(2.377,1.5)
  rect 0.28x0.905 smd: 8(-1.5,-2.377) 9(-1,-2.377) 10(-0.5,-2.377) 11(0,-2.377) 12(0.5,-2.377) 13(1,-2.377) 14(1.5,-2.377) 22(1.5,2.377) 23(1,2.377) 24(0.5,2.377) 25(0,2.377) 26(-0.5,2.377) 27(-1,2.377) 28(-1.5,2.377)
  rect 3.35x3.35 smd: 29(0,0)
R1206
  rect 1.208x1.701 smd: 1(-1.479,0) 2(1.479,0)
SOD-123_L2.7-W1.6-LS3.7-RD
  rect 0.91x1.22 smd: 1(-1.635,0) 2(1.635,0)
SOD-523_L1.2-W0.8-LS1.6-BI
  rect 0.6x0.4 smd: 1(-0.75,0) 2(0.75,0)
SOIC-16_L10.3-W7.5-P1.27-LS10.3-BL
  oval 0.574x2.401 smd: 1(-4.445,-4.75) 2(-3.175,-4.75) 3(-1.905,-4.75) 4(-0.635,-4.75) 5(0.635,-4.75) 6(1.905,-4.75) 7(3.175,-4.75) 8(4.445,-4.75) 9(4.445,4.75) 10(3.175,4.75) 11(1.905,4.75) 12(0.635,4.75) 13(-0.635,4.75) 14(-1.905,4.75) 15(-3.175,4.75) 16(-4.445,4.75)
SOT-23-3_L2.9-W1.3-P1.90-LS2.4-BR
  rect 1.25x0.7 smd: 1(1,-0.95) 2(1,0.95) 3(-1,0)
SOT-89-3_L4.5-W2.5-P1.50-LS4.2-BR
  rect 1.575x0.672 smd: 1(1.356,-1.5) 3(1.356,1.5)
  custom 5.377x1.9 smd: 2(-1.356,0)
SW-SMD_4P-L6.0-W6.0-P4.50-LS9.5
  rect 2.55x1.2 smd: 1(-4.075,2.25) 2(4.075,2.25) 3(-4.075,-2.25) 4(4.075,-2.25)
SW-TH_NIDEC_CL-SA-12C-02
  round 1.8 hole 1: 1(0,0) 2(-2.54,0) 3(2.54,0)
TO-252-2_L6.6-W6.1-P4.57-LS9.9-BR-CW
  rect 3x1.6 smd: 1(3.424,-2.29) 3(3.424,2.29)
  rect 6.2x5.8 smd: 2(-3.424,0)
WIRELM-SMD_ESP32-S3-WROOM-1
  rect 1.5x0.9 smd: 1(-8.75,8.895) 2(-8.75,7.625) 3(-8.75,6.355) 4(-8.75,5.085) 5(-8.75,3.815) 6(-8.75,2.545) 7(-8.75,1.275) 8(-8.75,0.005) 9(-8.75,-1.265) 10(-8.75,-2.535) 11(-8.75,-3.805) 12(-8.75,-5.075) 13(-8.75,-6.345) 14(-8.75,-7.615) 27(8.75,-7.615) 28(8.75,-6.345) 29(8.75,-5.075) 30(8.75,-3.805) 31(8.75,-2.535) 32(8.75,-1.265) 33(8.75,0.005) 34(8.75,1.275) 35(8.75,2.545) 36(8.75,3.815) 37(8.75,5.085) 38(8.75,6.355) 39(8.75,7.625) 40(8.75,8.895)
  rect 0.9x1.5 smd: 15(-6.985,-8.895) 16(-5.715,-8.895) 17(-4.445,-8.895) 18(-3.175,-8.895) 19(-1.905,-8.895) 20(-0.635,-8.895) 21(0.635,-8.895) 22(1.905,-8.895) 23(3.175,-8.895) 24(4.445,-8.895) 25(5.715,-8.895) 26(6.985,-8.865)
  rect 0.9x0.9 smd: 41(-2.9,2.575) 41(-2.9,1.175) 41(-2.9,-0.225) 41(-1.5,2.575) 41(-1.5,1.175) 41(-1.5,-0.225) 41(-0.1,2.575) 41(-0.1,1.175) 41(-0.1,-0.225)

## Nets
As in the schematic, except:
GND: BUZZER2.2 C1.1 C2.1 C3.1 C5.1 C6.1 C7.1 C8.1 C9.1 C10.1 C11.1 C12.1 C13.1 C14.1 C16.1 C17.1 CN1.1 CN2.1 CN3.1 CN4.1 CN6.1 CN6.2 D2.1 D3.1 D4.1 D6.1 D8.1 D9.1 D10.1 H2.2 H2.22 J2.5 J2.6 J2.7 J4.5 J4.6 J4.7 LED1.2 Q3.1 R14.2 R18.1 R26.2 R27.2 R_SENSE1.1 SW1(BOOT).1 SW2(RESET).1 U3.3 U4.1 U4.40 U4.41 U19.14 U19.15
IP: C4.2 U17.1 U19.5 U19.6 U19.7 U19.8

Pads without a net: D6 4; H2 18 20; J2 4; J4 4; NOREF 1; NOREF#2 1; NOREF#3 1; NOREF#4 1; SW1 2; SW1(BOOT) 2 3; SW2(RESET) 2 3; U3 1 2 10 12 13 14 15 16 17 18 19 20 21 22 23 27 29; U20 3 4

## Via types
v1: diameter 0.61, hole 0.305, Top Layer to Bottom Layer, 177 vias
v2: diameter 0.6, hole 0.35, Top Layer to Bottom Layer, 70 vias

## Routing (per net, layer and track width the routed paths; a pad name or vN(x,y) marks a point on that pad's centre or on a via; arc(x,y) is an arc through that point)
GND: length 30.2
  Top Layer w0.254: U4.41 v1(27.55,100.37) U4.41 v1(28.25,101.07) U4.41 ; U4.41 v1(28.25,99.67) U4.41 ; U4.41 v1(27.55,98.97) U4.41 v1(28.25,98.27) U4.41 ; v2(23.2,64.4) 22.96,64.16 22.96,59.66 21.06,57.75 v2(20.76,57.75) ; U4.41 v1(28.95,100.37) U4.41 ; U4.41 v1(29.65,101.07) U4.41 v1(30.35,100.37) ; U4.41 v1(29.65,99.67) ; U3.3 31.46,59.12 v2(31.85,59.5) ; v1(28.95,98.97) U4.41 ; U4.41 v1(29.65,98.27) U4.41 v1(30.35,98.97)
  Bottom Layer w0.254: v2(20.34,55.06) 21.74,53.66 24.03,53.66 25.62,52.07 v2(25.63,52.07)
  vias: v1(1.22,16.55) v1(1.47,13) v1(1.93,34.77) v1(2.11,14.78) v1(2.23,28.62) v1(2.26,48.56) v1(2.39,51.86) v1(2.62,11.47) v1(2.62,8.3) v1(2.74,16.93) v1(2.77,44.75) v1(3.28,59.23) v1(3.38,97.71) v1(3.38,10.08) v1(3.63,13.63) v1(4.27,92.5) v1(4.27,30.27) v1(4.27,16.43) v1(4.67,39.54) v1(4.65,27.86) v1(4.77,85.64) v1(4.8,55.29) v1(4.9,75.86) v1(5.05,58.59) v1(5.18,51.73) v1(5.31,48.18) v1(5.74,33.44) v1(5.66,6.77) v1(5.92,101.52) v1(6.3,106.34) v1(6.3,96.44) v1(6.55,91.36) v1(7.57,7.16) v1(8.97,5.63) v1(9.25,63.16) v1(9.6,29.38) v1(9.98,8.43) v1(10.26,81.55) v1(11.89,30.65) v1(11.89,8.55) v1(12.01,6.65) v1(12.52,27.6) v1(14.44,34.68) v1(14.53,29.58) v1(15.09,100.14) v1(15.14,67.12) v1(15.57,68.75) v1(15.7,64.94) v1(16.08,35.22) v1(16.08,31.79) v1(16.59,106.85) v1(16.71,75.74) v1(16.84,72.81) v1(17.35,5) v1(17.47,27.09) v1(18.85,74.34) v1(19.38,8.81) v1(19.51,76.75) v1(20.14,73.58) v1(20.42,24.45) v1(20.4,2.46) v1(20.52,28.11) v1(20.78,14.27) v1(23.44,94.4) v1(23.57,99.61) v1(23.57,97.33) v1(23.57,95.55) v1(23.65,101.91) v1(25.73,69.64) v1(25.88,105.83) v1(26.62,93.9) v1(27.13,66.59) v1(27.63,64.69) v1(27.66,94.4) v1(27.76,65.83) v1(27.89,70.4) v1(28.14,106.72) v1(28.17,93.13) v1(28.78,103.55) v1(29.18,44.14) v1(29.29,49.83) v1(29.54,47.29) v1(29.86,105.76) v1(29.86,104.09) v1(29.86,96.92) v1(30.56,95.04) v1(30.68,73.45) v1(31.44,93.52) v1(32,48.79) v1(32.21,103.04) v1(32.21,75.1) v1(32.33,69.26) v1(32.41,35.17) v1(32.59,94.28) v1(32.71,46.02) v1(32.97,97.07) v1(33.22,105.96) v1(33.48,16.68) v1(33.6,75.99) v1(34.11,14.65) v1(34.24,93.26) v1(34.26,100.02) v1(34.26,69.54) v1(34.26,54.3) v1(34.49,94.79) v1(35.64,104.44) v1(35.76,106.72) v1(36.02,98.09) v1(36.02,94.53) v1(36.14,23.54) v1(36.17,101.91) v1(36.42,27.2) v1(36.91,21) v1(38.3,23.28) v1(38.43,21) v1(38.76,49.09) v1(39.34,59.38) v1(39.34,44.14) v1(39.83,24.94) v1(40.72,89.45) v1(40.97,18.46) v1(41.6,22.9) v1(41.6,21.13) v1(41.86,19.22) v1(42.14,68.75) v1(42.11,29.51) v1(42.24,79.42) v1(42.24,76.5) v1(42.24,48.3) v1(42.37,72.05) v1(42.37,34.59) v1(42.87,27.48) v1(43,28.62) v1(43,23.03) v1(43.13,20.49) v1(43.64,65.83) v1(44.4,11.35) v1(44.6,49.7) v1(44.7,78.91) v1(44.78,75.61) v1(44.78,8.3) v1(45.16,54.02) v1(45.16,37.89) v1(45.41,34.31) v1(45.67,9.7) v1(46.18,62.78) v1(46.53,58.49) v1(46.68,45.51) v1(46.84,41.32) v1(47.04,79.88) v1(47.57,10.84) v1(47.95,32.94) v1(48.21,7.92)
VBUS: length 61.8
  Top Layer w0.254: 20.05,30.8 20.1,30.85 D2.2
  Top Layer w0.5: 44.36,15.47 44.53,15.65
  Top Layer w0.7: D1.2 27.17,31.09 ; v2(32.41,27.75) 33.48,26.69 33.48,19.4 37.41,15.47 44.36,15.47 ; v2(28.75,31.06) v2(28.11,31.06) 27.14,31.06 26.88,30.8 19.61,30.8 18.75,31.67 18.75,33.39 20.32,34.97 20.32,35.78
  Bottom Layer w0.7: v2(20.34,52.27) v2(20.34,35.72) v2(20.34,34.97) ; v2(32.41,27.75) 29.11,31.06 v2(28.75,31.06) 28.04,31.06
VBUSB: length 30.4
  Top Layer w0.5: 44.53,24.79 44.36,24.61
  Top Layer w0.7: D7.2 36.05,32.07 D8.2 36.55,29.79 41.73,24.61 44.36,24.61
  Top Layer w1: 28.17,20.01 30.14,20.01 30.58,20.46 30.58,27.86 32.51,29.79 36.55,29.79
VCC_3V3: length 110.8
  Top Layer w0.254: 25.07,67.3 D6.3
  Top Layer w0.4: R16.2 20.5,49.73 v2(18.54,47.77)
  Top Layer w0.5: 37.03,78.28 37.03,76.37 28.47,67.8 25.57,67.8 25.07,67.3 26.14,66.24 26.14,63.7 25.32,62.88 25.32,59.12 C11.2 ; C11.2 29.9,57.75 ; C11.2 23.34,57.75 21.99,56.41 R16.2 ; v2(6.93,19.19) 6.91,19.17 C16.2 ; 25.77,81.66 R24.1
  Top Layer w0.7: R1.1 39.11,78.28 34.42,78.28 v2(34.39,78.3) ; C10.2 28.17,79.19 29.03,78.32 v2(30.15,78.32) v2(30.93,78.32)
  Top Layer w1: R24.1 26.33,81.33 C10.2 26.33,77.42 25.25,76.34 C9.2 ; C1.2 25.77,81.66
  Bottom Layer w0.4: v2(6.93,19.19) 8,19.19 17.53,28.72 17.53,46.75 v2(18.54,47.77)
  Bottom Layer w0.7: v2(35.05,78.32) v2(30.93,78.32) v2(30.15,78.32)
VCC_5V: length 122.2
  Top Layer w0.5: 19.93,67.35 19.79,67.35 16.41,70.73 13.55,70.73 CN4.3 ; CN3.4 13.82,39.3 13.82,44.11 16.99,47.29 17.5,47.29 17.18,47.61 R25.2
  Top Layer w1: v2(40.34,81.5) v2(39.62,81.5) 35.01,81.5 33.33,79.83 33.33,78.45 C8.2 25.7,70.81 C7.2 23.28,70.7 19.93,67.35 17.5,64.91 17.5,47.24 19.71,45.03 24.54,45.03 C5.2 C3.2 30.44,36.47 D1.1 D7.1
  Bottom Layer w0.5: CN2.4 6.93,82.14 6.93,76.97 9.88,74.02 CN4.3
  Bottom Layer w1: H2.21 41.91,81.5 v2(40.34,81.5) 39.62,81.5
VINP: length 5.7
  Top Layer w1: R_SENSE1.2 6.82,12.32 ; 6.82,12.32 8.21,12.32 R29.2 ; 6.82,12.32 6.93,12.43 U19.16
CHIP_PU: length 97.1
  Top Layer w0.3: C14.2 22.64,35.85 v2(19.05,39.44) 19.05,39.49 SW2(RESET).4
  Top Layer w0.5: C6.2 R5.1 30.18,84.52 ; v2(26.39,104.21) 25.89,104.71 21.84,104.71 U4.3
  Bottom Layer w0.3: v2(19.05,39.44) 19.25,39.64 19.25,58.93 20.27,59.95 20.27,62.02 21.67,63.42 27.48,63.42 v1(29.1,61.79)
  Bottom Layer w0.5: v2(26.39,104.21) 26.64,103.95 26.64,97.1 30.15,93.59 v2(30.15,84.53) 30.15,83.58 29.1,82.54 v1(29.1,61.79)
DTR: length 9
  Top Layer w0.254: Q2.2 34.18,63.09 R10.1 34.18,57.78 U3.28
ESP_3V3: length 49.7
  Top Layer w0.5: R24.2 26.09,84.52 R5.2
  Top Layer w1: H2.1 25.62,108.68 v1(23.06,106.12) U4.2
  Top Layer w1.5: 25.88,86.81 v2(25.88,86.01) R24.2
  Bottom Layer w1: v2(25.88,86.01) v2(25.88,87.16) 24.88,88.16 24.88,104.96 v1(23.72,106.12) 23.06,106.11 v1(23.06,106.12)
GPIO0: length 76.7
  Top Layer w0.3: C13.2 35.85,40.35 SW1(BOOT).4 33.24,44.13 v2(35.15,46.04) ; U4.27 38.9,91.18 36.12,91.18 v2(35.79,90.85) ; v2(35.79,76.75) 35.79,76.27 28.07,68.55 24.54,68.55 24.13,68.14 24.13,61.9 R13.2
  Bottom Layer w0.3: v2(35.79,90.85) v2(35.79,76.75) ; v2(35.15,46.04) 35.15,58.74 33.56,60.34 25.56,60.34 v2(24.1,61.79)
GPIO1: length 4.5
  Bottom Layer w0.254: H2.3 43.67,106.12 v2(39.2,106.12)
GPIO2: length 5
  Bottom Layer w0.254: H2.5 42.44,104.85 v2(39.2,104.85)
GPIO4: length 12
  Top Layer w0.5: 21.68,103.6 11.58,103.6 CN1.2
GPIO5: length 12.5
  Top Layer w0.5: CN1.3 12.81,102.33 21.72,102.33
GPIO6: length 20.6
  Top Layer w0.254: CN2.3 11.37,89.08 13.29,89.08 16.1,91.89 16.1,98.26 18.88,101.04 U4.6
GPIO7: length 17.2
  Top Layer w0.254: v2(17.37,94.61) 17.37,97.81 19.33,99.77 U4.7
  Bottom Layer w0.254: CN2.2 13.29,90.47 17.37,94.56 v2(17.37,94.61)
GPIO8: length 32.1
  Top Layer w0.254: BUZZER2.1 11.34,69.12 9.22,71.24 9.22,80.16 9.65,80.59 11.68,80.59 19.46,88.36 19.46,92.1 20.78,93.42 U4.12
GPIO9: length 21.7
  Top Layer w0.254: CN4.2 12.18,76.52 21.93,86.28 23.57,86.28 26.01,88.71 U4.17
GPIO10: length 53.4
  Top Layer w0.254: U4.18 27.28,88.57 29.45,86.4 38.74,86.4 39.49,85.65 39.49,83.77 42.37,80.89 48.21,80.89 49.48,82.16 49.48,102.89 H2.4
GPIO11: length 49.2
  Top Layer w0.254: H2.6 46.43,103.6 49.12,100.91 49.12,82.31 48.11,81.3 42.47,81.3 39.85,83.92 39.85,85.8 38.86,86.78 29.62,86.78 28.55,87.85 U4.19
GPIO12: length 44
  Top Layer w0.254: H2.8 48.77,98.52 48.77,82.51 47.96,81.7 42.57,81.7 40.2,84.07 40.2,85.95 39.01,87.14 31.04,87.14 29.82,88.36 U4.20
GPIO13: length 39.1
  Top Layer w0.254: H2.10 48.41,96.34 48.41,82.72 47.75,82.06 42.71,82.06 40.56,84.22 40.56,86.1 39.16,87.5 32.21,87.5 31.09,88.61 U4.21
GPIO14: length 31.2
  Top Layer w0.254: U4.22 32.36,88.92 33.43,87.85 39.31,87.85 40.91,86.25 40.91,85.14 41.66,84.4 48.06,84.4 48.06,94.15 H2.12
GPIO15: length 67.5
  Top Layer w0.254: U4.8 19.76,98.5 18.29,97.03 18.29,94 v2(17.37,93.08)
  Bottom Layer w0.254: 10.26,38.19 10.14,38.19 8.79,39.54 8.79,44.47 12.85,48.53 12.85,76.22 16.66,80.03 16.66,92.37 v2(17.37,93.08)
GPIO16: length 62.2
  Top Layer w0.254: U4.9 20.15,97.23 19.2,96.28 19.2,93.64 v2(17.37,91.81)
  Bottom Layer w0.254: v2(17.37,91.81) 17.37,80.08 13.31,76.01 13.31,43.74 10.26,40.69
GPIO17: length 44.4
  Top Layer w0.254: v2(15.04,58.72) R30.2 ; U4.10 20.55,95.96 20.07,95.47 v2(20.07,93.85) ; U4.10 21.69,95.95 21.7,95.95 U4.10
  Bottom Layer w0.254: v2(15.04,58.72) 13.77,59.98 13.77,75.77 20.07,82.06 v2(20.07,93.85)
GPIO19: length 85.6
  Top Layer w0.254: U4.13 21.71,92.14 v2(35.53,92.14) ; 44.53,25.44 44.51,25.47 42.54,25.47 38.71,29.29 D9.2 38.35,31.58 37.69,32.23 37.69,33.34 v2(36.93,34.1)
  Bottom Layer w0.254: v2(36.93,34.1) 36.93,60.01 36.42,60.52 36.42,91.25 v2(35.53,92.14)
GPIO20: length 84.5
  Top Layer w0.254: v2(27.33,90.95) 21.78,90.95 U4.14 ; v2(41.12,31.58) 41.12,27.73 42.77,26.08 44.52,26.08 44.53,26.09 ; v2(27.94,86.73) 28.63,86.05 38.28,86.05 v2(38.91,85.41)
  Bottom Layer w0.254: v2(38.91,85.41) 38.76,85.26 38.76,81.2 40.77,79.19 40.77,31.93 v2(41.12,31.58) ; v2(27.94,86.73) 27.94,90.34 v2(27.33,90.95)
GPIO21: length 22.4
  Top Layer w0.254: H2.14 47.7,91.97 47.7,87.7 46.9,86.9 40.77,86.9 39.46,88.21 34.04,88.21 33.63,88.61 U4.23
GPIO35: length 8.7
  Bottom Layer w0.254: v2(39.2,92.15) 40.13,92.15 41.81,90.47 41.81,87.7 H2.19
GPIO36: length 7.5
  Bottom Layer w0.254: H2.17 42.37,89.68 42.37,91.18 40.13,93.42 v2(39.2,93.42)
GPIO37: length 6.3
  Bottom Layer w0.254: v2(39.2,94.69) 40.3,94.69 43.69,91.31 H2.15
GPIO38: length 49.2
  Top Layer w0.254: v2(23.6,92.78) 26.78,95.96 U4.31 ; v2(21.18,66.24) 21.18,62.51 R17.1
  Bottom Layer w0.254: v2(23.6,92.78) 23.6,91.25 21.18,88.84 v2(21.18,66.24)
GPIO39: length 6.5
  Bottom Layer w0.254: v2(39.2,97.23) 40.71,97.23 43.18,94.76 43.18,93.95 H2.13
GPIO40: length 5.5
  Bottom Layer w0.254: v2(39.2,98.5) 41.07,98.5 43.59,95.98 H2.11
GPIO41: length 5
  Bottom Layer w0.254: v2(39.2,99.77) 41.47,99.77 42.72,98.52 H2.9
GPIO42: length 4.5
  Bottom Layer w0.254: H2.7 43.67,101.04 v2(39.2,101.04)
GPIO47: length 17.5
  Top Layer w0.254: H2.16 47.34,89.78 47.34,87.85 46.75,87.25 40.91,87.25 39.61,88.56 35.36,88.56 34.9,89.02 U4.24
IP+: length 25.3
  Top Layer w1.5: SW1.3 41.65,12.31 R28.1
RTS: length 22.9
  Top Layer w0.254: 40.04,64.85 40.04,64.6 42.22,62.42 R12.1 42.27,61.75 42.27,54.42 40.49,52.65 35.41,52.65 35.03,53.03 35.03,54.68 34.76,54.94 U3.24
SCL: length 75.8
  Top Layer w0.4: U4.15 23.47,88.3 23.07,87.9 21.18,87.9 v2(11.38,78.1)
  Bottom Layer w0.4: v2(6.93,21.73) 6.93,67.71 11.38,72.15 v2(11.38,78.1)
SDA: length 77.4
  Top Layer w0.4: U4.16 24.74,88.51 23.37,87.14 21.79,87.14 v2(12.04,77.39)
  Bottom Layer w0.4: v2(12.04,77.39) 12.04,71.8 7.72,67.48 7.72,21.25 v2(6.93,20.46)
U0RXD: length 46.4
  Bottom Layer w0.254: v2(39.22,102.3) 38.33,101.41 38.33,57.35 38.96,56.71 39.09,56.71
  vias: v2(39.17,56.71)
U0TXD: length 51.1
  Bottom Layer w0.254: 39.22,54.04 38.71,54.04 37.69,55.06 37.69,102.07 v2(39.2,103.58)
  vias: v2(39.24,54.04)
USB_DN: length 62
  Top Layer w0.35: U3.5 30.46,58.87 30.36,58.97 v2(29.44,58.97) ; v2(36.07,18.1) 37.85,16.32 44.51,16.32 44.53,16.3
  Bottom Layer w0.35: v2(36.07,18.1) 22.42,31.75 v2(22.42,31.78) 21.28,32.92 21.28,37.24 27.88,43.84 27.88,57.95 28.91,58.97 v2(29.44,58.97)
USB_DP: length 61.3
  Top Layer w0.35: v2(25.5,42.69) 25.5,38.93 27.15,37.28 27.15,33.99 v2(24.87,31.7) ; 44.53,16.95 44.51,16.97 38.22,16.97 36.31,18.88 v2(36.3,18.88) ; v2(30.33,59.61) 30.69,59.61 30.96,59.34 U3.4
  Bottom Layer w0.35: v2(30.33,59.61) 28.78,59.61 27.41,58.23 27.41,45.03 25.5,43.12 v2(25.5,42.69) ; 36.3,18.86 24.87,30.29 v2(24.87,31.7)
$1N5776: length 8.9
  Top Layer w0.35: U3.8 27.96,56.94 26.27,55.26 C12.2
  Top Layer w0.5: R18.2 23.5,55.26 25.62,55.26 C12.2
  Top Layer w0.7: R18.2 R19.2
$1N5824: length 8.9
  Top Layer w0.254: R16.1 25.63,49.73 27.15,51.25 27.15,55.5 28.1,56.44 U3.9
$1N5829: length 10.3
  Top Layer w0.254: U3.11 27.91,55.44 27.66,55.19 27.66,49.77 24.95,47.06 R14.1
$1N5930: length 3.2
  Top Layer w0.254: R7.1 35.44,55.94 U3.26
$1N5933: length 3.5
  Top Layer w0.254: R9.1 36.21,54.17 34.94,55.44 U3.25
$1N6311: length 3.5
  Top Layer w0.254: R10.2 38.14,62.79 Q1.1
$1N6314: length 18
  Top Layer w0.254: Q2.1 30.58,64.92 30.58,67.38 31.09,67.89 39.43,67.89 39.73,67.59 39.73,66.11 39.26,65.65 R12.2
$1N6341: length 11.9
  Top Layer w0.254: R8.1 31.6,62.25 31.6,65.47 32.98,66.85 Q1.3
$1N6344: length 8
  Top Layer w0.254: R13.1 28.63,63.44 30.48,63.44 31.24,64.21 31.24,65.62 31.47,65.85 Q2.3
$1N6473: length 8.3
  Bottom Layer w0.254: v1(25,64.4) 23.86,65.55 22.34,65.55 18.94,62.15 v1(18.94,61.79)
$1N6796: length 2.3
  Top Layer w0.254: R1.2 LED1.1
$1N25492: length 5.4
  Top Layer w0.5: R25.1 13.67,49.15 CN6.4
$1N27294: length 2.7
  Top Layer w0.5: U19.10 6.91,22.98 R26.1
$1N27297: length 3.2
  Top Layer w0.5: R27.1 5.47,24.27 U19.9
$1N27555: length 2.3
  Top Layer w1: R28.2 R29.1
$1N27664: length 34.9
  Bottom Layer w1: v2(30.45,16.55) v2(31.22,16.55) ; v2(30.45,16.55) v2(21.31,16.55) v2(20.55,16.55) ; v2(30.45,16.55) 30.9,16.11 30.9,2.95 U20.2
  Bottom Layer w1.5: 25.91,17.3 v1(25.91,25.32) v2(25.91,25.98)
$1N27833: length 5.4
  Top Layer w0.254: R30.1 13.54,51.65 CN6.3
$1N34757: length 20.4
  Top Layer w1.5: SW1.1 32.66,9.72 U20.1

## Copper pours and planes (outline as drawn; the poured copper is in the pictures)
GND on Top Layer: 20.74,110.38 20.74,108.37 39.83,108.37 40.01,108.55 40.01,110.41 50.39,110.41 50.39,-0.21 19.44,-0.21 19.44,17.44 25.27,17.44 25.27,23.08 20.88,23.08 19.66,24.3 19.66,26.08 14.2,26.08 14.2,-0.21 3.02,-0.21 -0.53,3.35 -0.53,110.41 -0.03,110.41 0,110.38
GND on Bottom Layer: -1.03,111.42 51.03,111.42 51.03,-1.73 -1.03,-1.73
IP on Top Layer: 14.78,20.08 18.75,20.08 20.88,17.95 24.8,17.95 24.8,22.47 19.15,22.47 19.15,25.54 14.78,25.54
IP+ on Top Layer: 18.29,19.58 18.29,10.79 14.91,10.79 14.91,19.58
